# EAGLE design FemtoI2C (EAGLE 6.4)
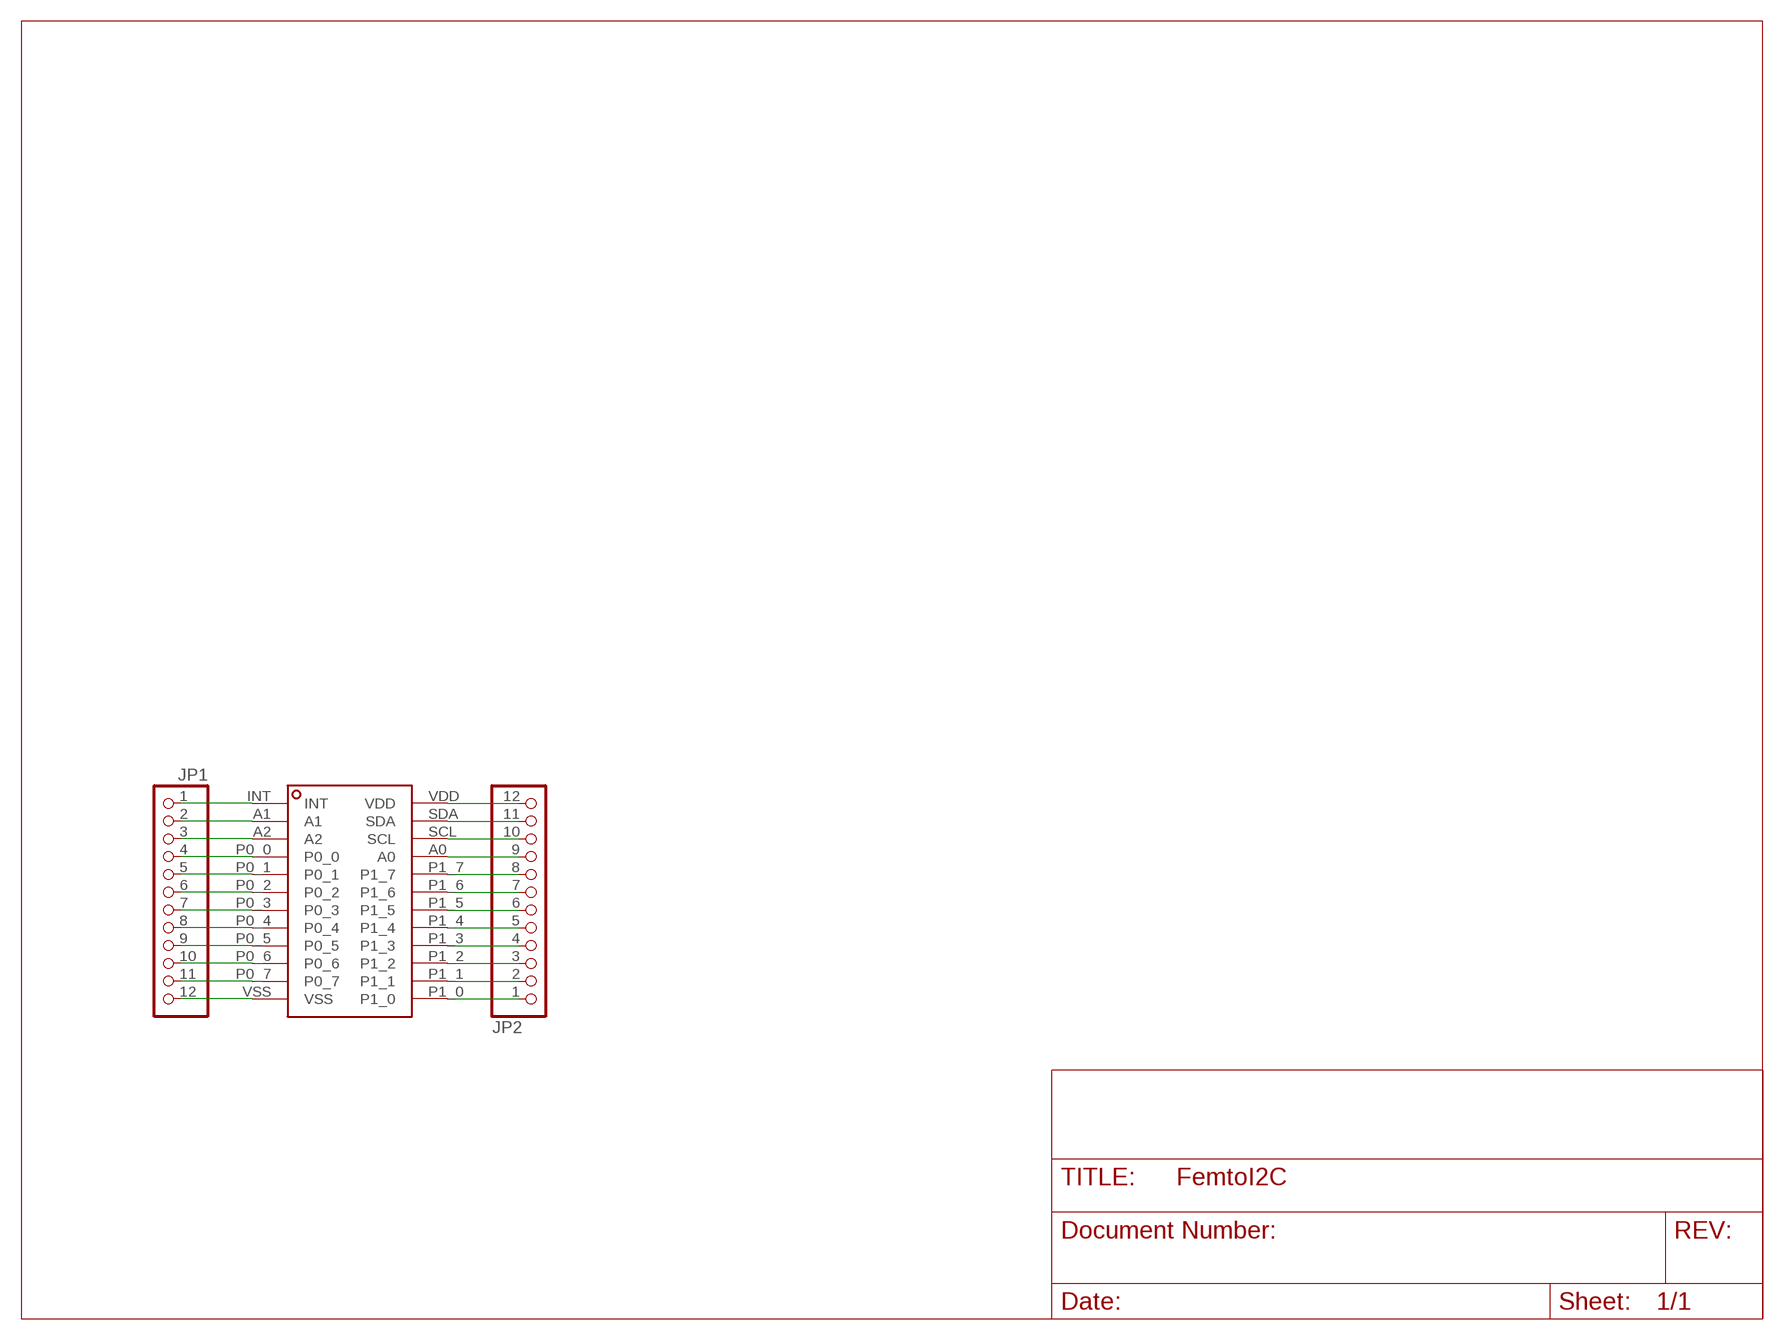
[diagram p0: schematic, sheet 1]

## Parts
JP1  PINHD-1X12  [1X12]
JP2  PINHD-1X12  [1X12]
U$1  PCA9555A_TSSOP24  [PCA9555A_TSSOP24]

## Nets
N$1: JP1.1 U$1.INT
N$2: JP1.2 U$1.A1
N$3: JP1.3 U$1.A2
N$4: JP1.4 U$1.P0_0
N$5: JP1.5 U$1.P0_1
N$6: JP1.6 U$1.P0_2
N$7: JP1.7 U$1.P0_3
N$8: JP1.8 U$1.P0_4
N$9: JP1.9 U$1.P0_5
N$10: JP1.10 U$1.P0_6
N$11: JP1.11 U$1.P0_7
N$12: JP1.12 U$1.VSS
N$13: JP2.1 U$1.P1_0
N$14: JP2.2 U$1.P1_1
N$15: JP2.3 U$1.P1_2
N$16: JP2.4 U$1.P1_3
N$17: JP2.5 U$1.P1_4
N$18: JP2.6 U$1.P1_5
N$19: JP2.7 U$1.P1_6
N$20: JP2.8 U$1.P1_7
N$21: JP2.9 U$1.A0
N$22: JP2.10 U$1.SCL
N$23: JP2.11 U$1.SDA
N$24: JP2.12 U$1.VDD

## Library data of the parts
JP1 JP2 = pinhead:PINHD-1X12: PIN HEADER
U$1 = femtoBus:PCA9555A_TSSOP24

## Board
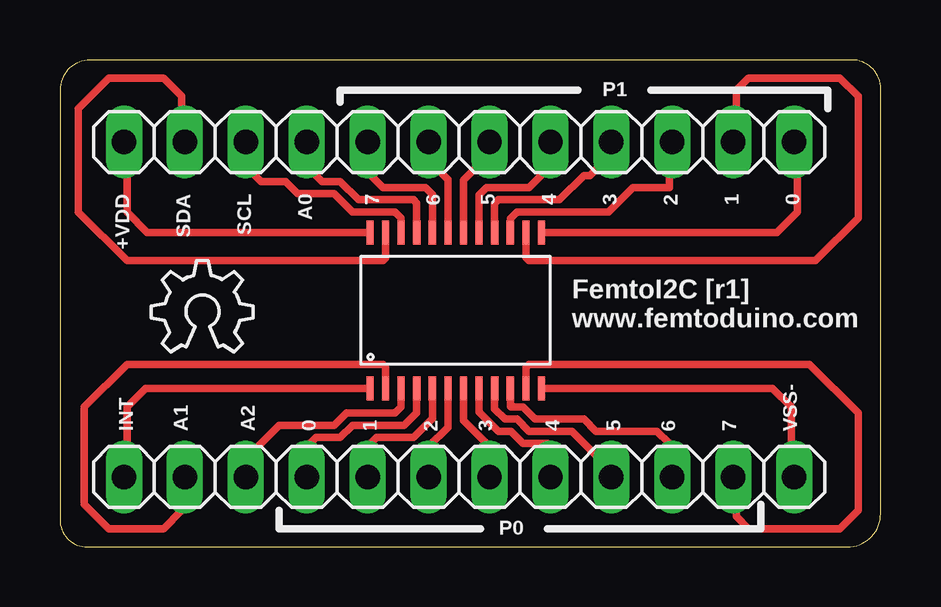
[diagram p1: board, top side]

Size 34.21 x 20.31 mm. Coordinates in mm from the lower left corner, seen from the top.
Outline: 0,19.05 0,1.14 arc90 1.14,0 32.83,0 arc90 34.21,1.38 34.21,19.11 arc90 33.01,20.31 1.26,20.31 arc90 0,19.05
Copper layers (1*16): Top 0.035mm / dielectric 1.5mm / Bottom 0.035mm
Design rules "default": minimum track width 10mil, minimum drill 24mil, track to track 8mil, track to pad 8mil, pad to pad 8mil, via to via 8mil, smd to smd 8mil, copper to edge 40mil, drill to drill 8mil, minimum pad ring 10mil, minimum via ring 8mil, stop-mask expansion 4mil, vias tented up to drill 0mil, thermal gap 10mil

### Footprints (pad centres in the part's own frame; a part is rotated, then mirrored left to right if it is on the bottom)
1X12 = drill 1.016 long: 1 -13.97,0; 2 -11.43,0; 3 -8.89,0; 4 -6.35,0; 5 -3.81,0; 6 -1.27,0; 7 1.27,0; 8 3.81,0; 9 6.35,0; 10 8.89,0; 11 11.43,0; 12 13.97,0
PCA9555A_TSSOP24 = smd 1 x 0.3: A0 5.5,5.575; A1 -1,6.875; A2 -1,6.225; INT -1,7.525; P0_0 -1,5.575; P0_1 -1,4.925; P0_2 -1,4.275; P0_3 -1,3.625; P0_4 -1,2.975; P0_5 -1,2.325; P0_6 -1,1.675; P0_7 -1,1.025; P1_0 5.5,0.375; P1_1 5.5,1.025; P1_2 5.5,1.675; P1_3 5.5,2.325; P1_4 5.5,2.975; P1_5 5.5,3.625; P1_6 5.5,4.275; P1_7 5.5,4.925; SCL 5.5,6.225; SDA 5.5,6.875; VDD 5.5,7.525; VSS -1,0.375

### Placement (x,y rotation side)
JP1  16.64,2.92 0 top
JP2  16.64,16.89 180 top
U$1  20.45,7.62 90 top
U$2  [OSHW_6X150_NOTEXT]  3.81,8.13 0 top

### Tracks (layer width: path | path; a pad name or v marks a point on that pad's centre or on a via)
N$1
  Top 0.305: U$1.INT 3.57,6.62 2.79,5.84 2.79,3.05 JP1.1
N$2
  Top 0.305: U$1.A1 13.57,7.51 13.46,7.62 2.79,7.62 1.02,5.84 1.02,1.78 2.03,0.76 4.32,0.76 5.08,1.52 5.08,2.79 JP1.2
N$3
  Top 0.305: U$1.A2 14.22,5.84 13.97,5.59 11.94,5.59 11.43,5.08 9.14,5.08 7.87,3.81 7.87,3.05 JP1.3
N$4
  Top 0.305: U$1.P0_0 14.87,5.6 14.35,5.08 12.19,5.08 11.68,4.57 10.67,4.57 10.29,4.19 JP1.4
N$5
  Top 0.305: U$1.P0_1 15.52,5.36 14.73,4.57 13.21,4.57 12.83,4.19 JP1.5
N$6
  Top 0.305: U$1.P0_2 16.17,5 15.37,4.19 JP1.6
N$7
  Top 0.305: U$1.P0_3 16.82,5.28 17.91,4.19 JP1.7
N$8
  Top 0.305: U$1.P0_4 17.47,5.64 18.29,4.83 18.8,4.83 19.3,4.32 20.32,4.32 20.32,3.05 JP1.8
N$9
  Top 0.305: U$1.P0_5 18.12,5.75 18.54,5.33 19.05,5.33 19.56,4.83 21.34,4.83 22.61,3.56 22.61,3.3 JP1.9
N$10
  Top 0.305: U$1.P0_6 18.77,5.87 18.8,5.84 19.3,5.84 19.81,5.33 21.84,5.33 22.35,4.83 24.89,4.83 25.4,4.32 25.4,3.05 JP1.10
N$11
  Top 0.305: U$1.P0_7 19.42,7.48 19.56,7.62 31.24,7.62 33.27,5.59 33.27,1.52 32.51,0.76 28.7,0.76 28.19,1.27 28.19,2.79 JP1.11
N$12
  Top 0.305: U$1.VSS 29.7,6.62 30.48,5.84 30.48,3.05 JP1.12
N$13
  Top 0.305: U$1.P1_0 29.88,13.12 30.73,13.97 30.73,16.76 JP2.1
N$14
  Top 0.305: U$1.P1_1 19.42,12.07 19.56,11.94 31.5,11.94 33.27,13.72 33.27,18.8 32.51,19.56 28.7,19.56 28.19,19.05 28.19,17.02 JP2.2
N$15
  Top 0.305: U$1.P1_2 18.77,13.69 19.05,13.97 22.86,13.97 23.88,14.99 25.4,14.99 25.4,16.76 JP2.3
N$16
  Top 0.305: U$1.P1_3 18.12,14.31 18.29,14.48 20.83,14.48 21.84,15.49 22.1,15.49 22.86,16.26 22.86,16.76 JP2.4
N$17
  Top 0.305: U$1.P1_4 17.47,14.68 17.78,14.99 19.56,14.99 20.57,16 20.57,16.76 JP2.5
N$18
  Top 0.305: U$1.P1_5 16.82,15.3 17.78,16.26 17.78,16.76 JP2.6
N$19
  Top 0.305: U$1.P1_6 16.17,15.32 15.49,16 15.49,16.76 JP2.7
N$20
  Top 0.305: U$1.P1_7 15.52,14.7 15.24,14.99 13.46,14.99 12.7,15.75 12.7,16.76 JP2.8
N$21
  Top 0.305: U$1.A0 14.87,14.34 14.73,14.48 12.45,14.48 11.68,15.24 10.92,15.24 10.41,15.75 10.41,16.76 JP2.9
N$22
  Top 0.305: U$1.SCL 14.22,13.72 13.97,13.97 12.19,13.97 11.43,14.73 9.91,14.73 9.4,15.24 8.38,15.24 7.87,15.75 7.87,16.76 JP2.10
N$23
  Top 0.305: U$1.SDA 13.57,12.05 13.46,11.94 2.79,11.94 0.76,13.97 0.76,18.29 2.03,19.56 4.32,19.56 5.08,18.8 5.08,17.02 JP2.11
N$24
  Top 0.305: U$1.VDD 3.64,13.12 2.79,13.97 2.79,16.76 JP2.12

### Text on the board
tPlace: P1 | +VDD | SDA | SCL | A0 | 7 | 6 | 5 | 4 | 3 | 2 | 1 | 0 | FemtoI2C [r1] / www.femtoduino.com | INT | A1 | A2 | 0 | 1 | 2 | 3 | 4 | 5 | 6 | 7 | VSS- | P0